# Altium schematic sheet Controller.SchDoc
size A2
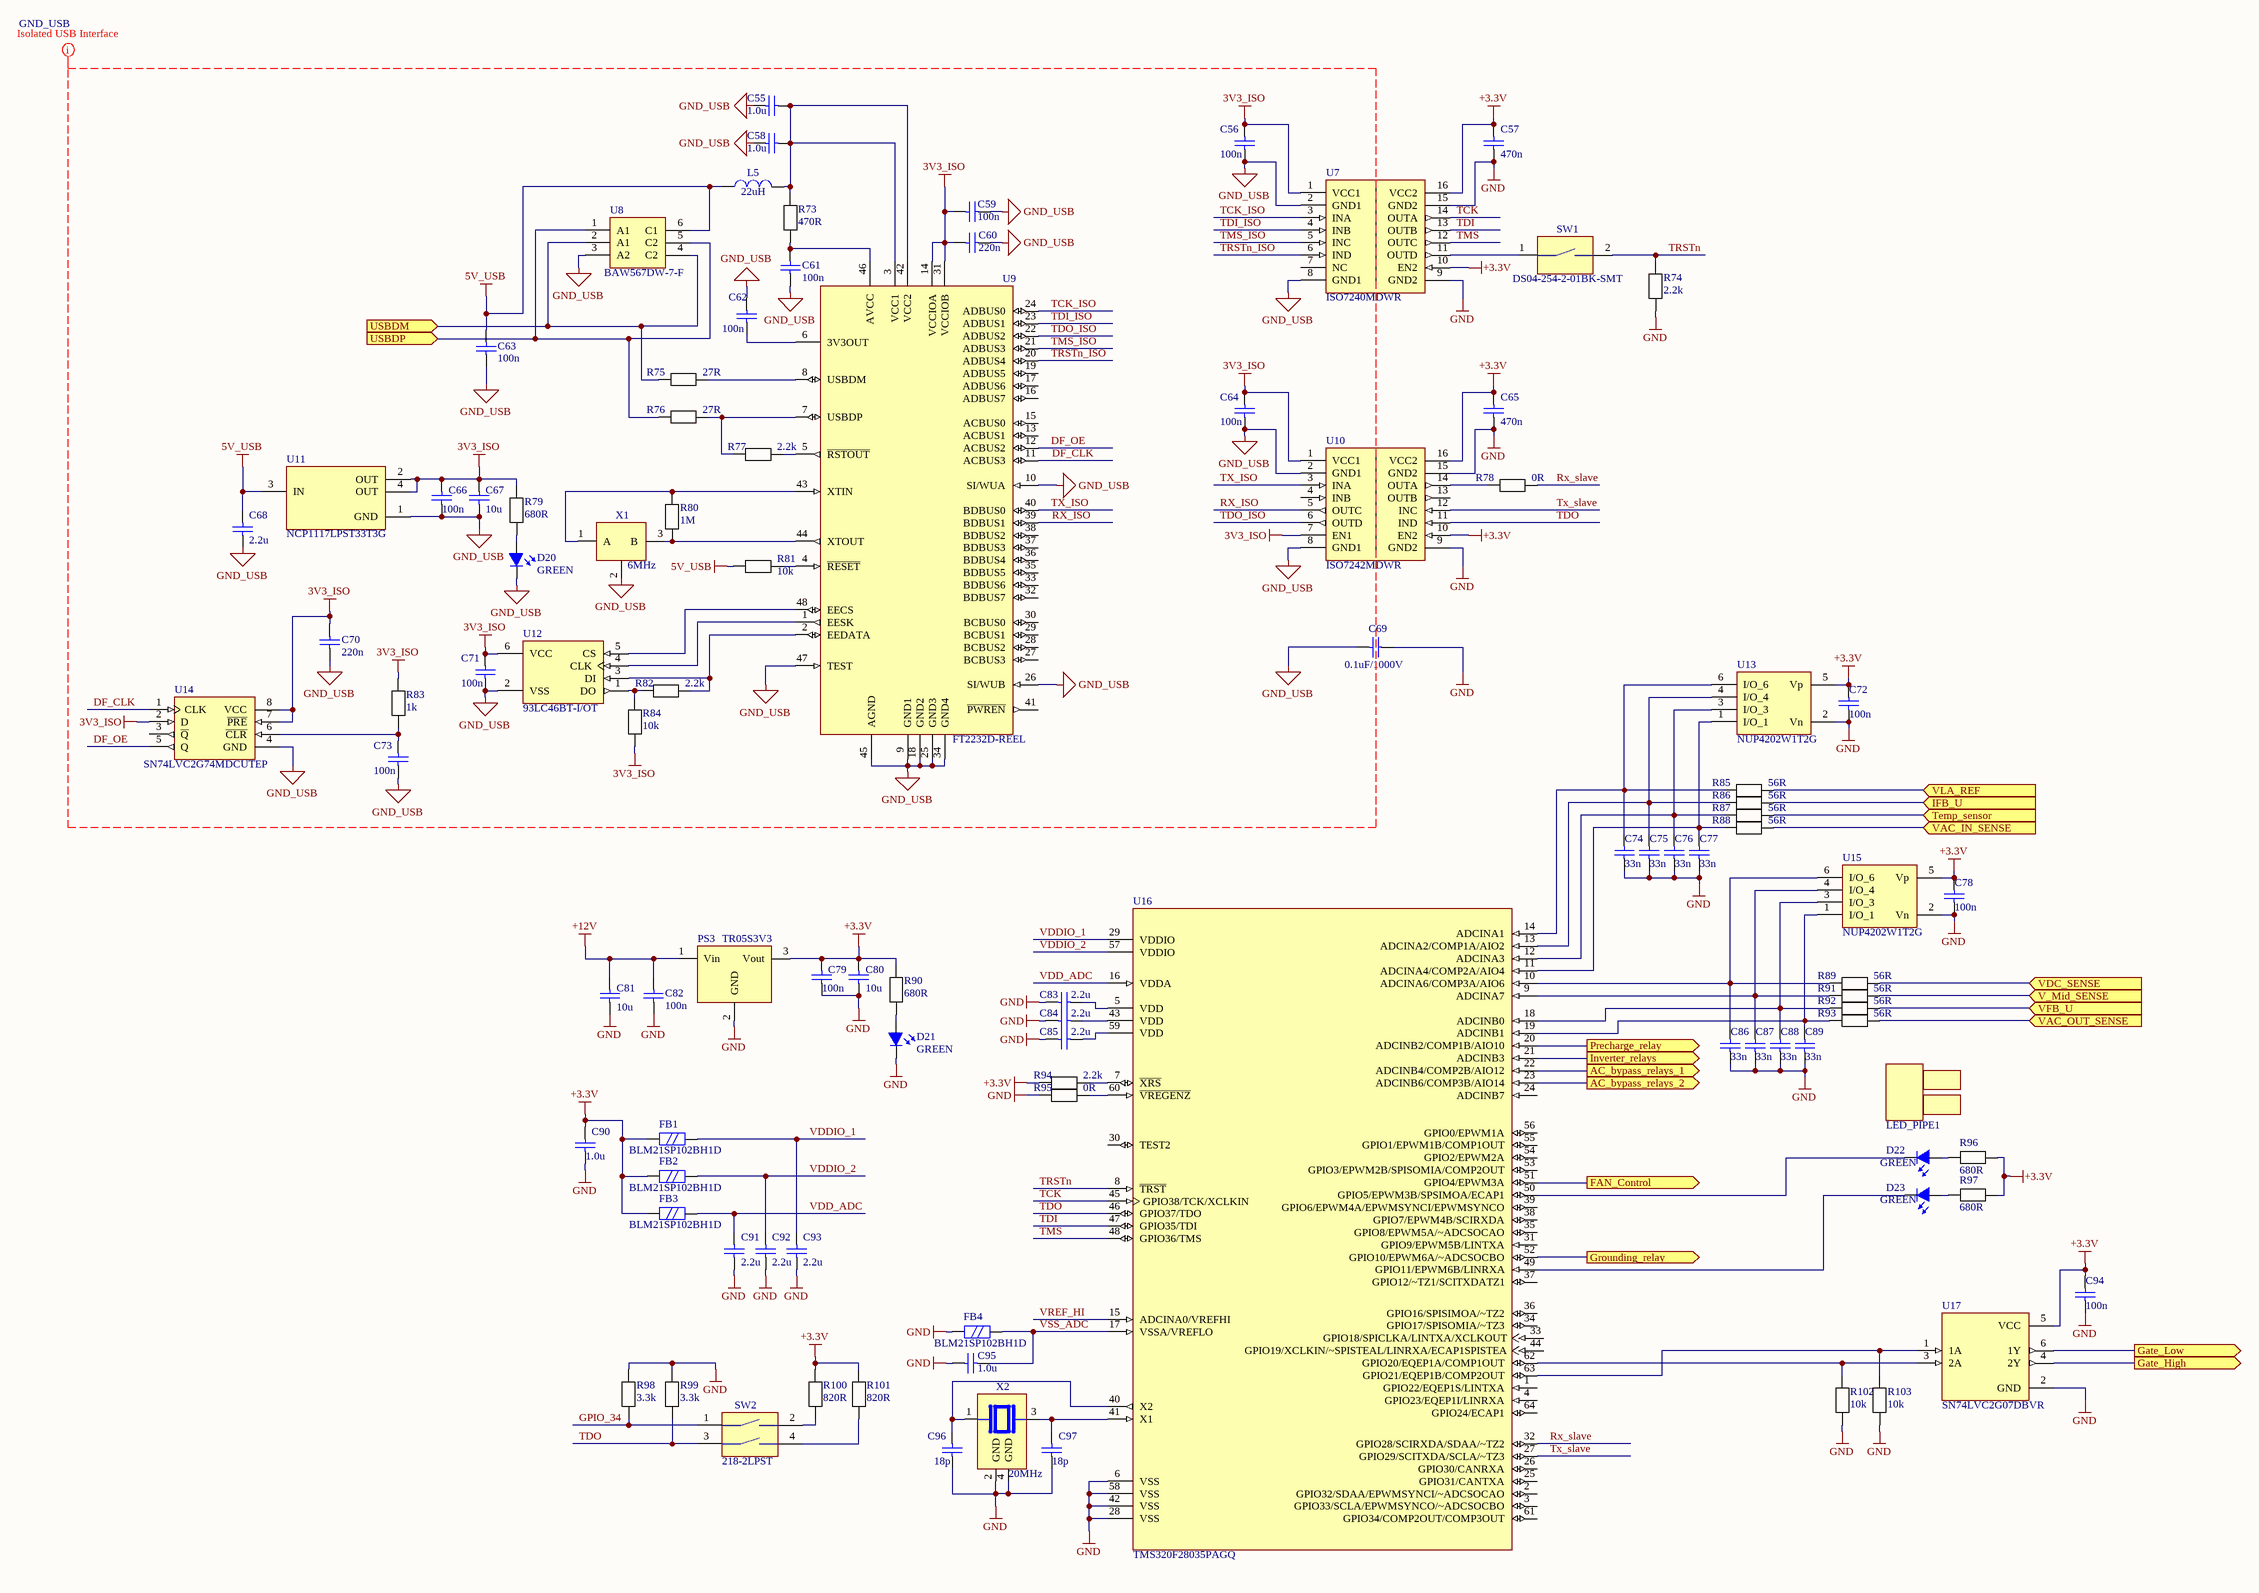
[diagram p0: Controller.SchDoc]

## Parts
C55  1.0u  [C0603]
C56  100n  [C0603]
C57  470n  [C0603]
C58  1.0u  [C0603]
C59  100n  [C0603]
C60  220n  [C0603]
C61  100n  [C0603]
C62  100n  [C0603]
C63  100n  [C0603]
C64  100n  [C0603]
C65  470n  [C0603]
C66  100n  [C0603]
C67  10u  [C1206]
C68  2.2u  [C0603]
C69  0.1uF/1000V  [C1812]
C70  220n  [C0603]
C71  100n  [C0603]
C72  100n  [C0603]
C73  100n  [C0603]
C74  33n  [C0603]
C75  33n  [C0603]
C76  33n  [C0603]
C77  33n  [C0603]
C78  100n  [C0603]
C79  100n  [C0603]
C80  10u  [C1206]
C81  10u  [C1206]
C82  100n  [C0603]
C83  2.2u  [C0603]
C84  2.2u  [C0603]
C85  2.2u  [C0603]
C86  33n  [C0603]
C87  33n  [C0603]
C88  33n  [C0603]
C89  33n  [C0603]
C90  1.0u  [C0603]
C91  2.2u  [C0603]
C92  2.2u  [C0603]
C93  2.2u  [C0603]
C94  100n  [C0603]
C95  1.0u  [C0603]
C96  18p  [C0603]
C97  18p  [C0603]
D20  GREEN  [LED0805]
D21  GREEN  [LED0805]
D22  GREEN  [LED0805]
D23  GREEN  [LED0805]
FB1  BLM21SP102BH1D  [R0805]
FB2  BLM21SP102BH1D  [R0805]
FB3  BLM21SP102BH1D  [R0805]
FB4  BLM21SP102BH1D  [R0805]
L5  22uH  [IND_NRH3012T]
LED_PIPE1  RLP2-400-800  [RLP2-400-800]  (value not drawn)
PS3  TR05S3V3  [TR05S3V3]
R73  470R  [R0603]
R74  2.2k  [R0603]
R75  27R  [R0603]
R76  27R  [R0603]
R77  2.2k  [R0603]
R78  0R  [R0603]
R79  680R  [R0603]
R80  1M  [R0603]
R81  10k  [R0603]
R82  2.2k  [R0603]
R83  1k  [R0603]
R84  10k  [R0603]
R85  56R  [R0603]
R86  56R  [R0603]
R87  56R  [R0603]
R88  56R  [R0603]
R89  56R  [R0603]
R90  680R  [R0603]
R91  56R  [R0603]
R92  56R  [R0603]
R93  56R  [R0603]
R94  2.2k  [R0603]
R95  0R  [R0603]
R96  680R  [R0603]
R97  680R  [R0603]
R98  3.3k  [R0603]
R99  3.3k  [R0603]
R100  820R  [R0603]
R101  820R  [R0603]
R102  10k  [R0603]
R103  10k  [R0603]
SW1  DS04-254-2-01BK-SMT  [SW_DS04-254-2-01BK-SMT]
SW2  218-2LPST  [218-2LPST]
U7  ISO7240MDWR  [SOIC127P1030X265-16N]
U8  BAW567DW-7-F  [SOT65P210X110-6N]
U9  FT2232D-REEL  [LQFP48]
U10  ISO7242MDWR  [SOIC127P1030X265-16N]
U11  NCP1117LPST33T3G  [SOT223R]
U12  93LC46BT-I/OT  [SOT95P280X145-6N]
U13  NUP4202W1T2G  [SOT65P210X110-6N]
U14  SN74LVC2G74MDCUTEP  [SOP50P310X90-8N]
U15  NUP4202W1T2G  [SOT65P210X110-6N]
U16  TMS320F28035PAGQ  [QFP50P1200X1200X120-64N]
U17  SN74LVC2G07DBVR  [SOT95P280X145-6N]
X1  6MHz  [OSC_CSTCR6M00G53-R0]
X2  20MHz  [XTAL_AMB8]

## Ports
AC_bypass_relays_1 (out), AC_bypass_relays_2 (out), FAN_Control (out), Gate_High (out), Gate_Low (out), Grounding_relay (out), IFB_U (in), Inverter_relays (out), Precharge_relay (out), Temp_sensor (in), USBDM (in), USBDP (in), V_Mid_SENSE (in), VAC_IN_SENSE (in), VAC_OUT_SENSE (in), VDC_SENSE (in), VFB_U (in), VLA_REF (in)

## Nets
3V3_ISO: C56.2 C59.2 C60.2 C64.2 C66.2 C67.2 C70.2 C71.2 R79.2 R83.2 R84.1 U7.1(VCC1) U9.14(VCCIOA) U9.31(VCCIOB) U10.1(VCC1) U10.7(EN1) U11.2(OUT) U11.4(OUT) U12.6(VCC) U14.2(D) U14.7(~{PRE}) U14.8(VCC)
5V_USB: C63.2 C68.2 L5.1 R81.1 U8.6(C1) U11.3(IN)
+3.3V: C57.2 C65.2 C72.2 C78.2 C79.2 C80.2 C90.2 C94.2 FB1.2 FB2.2 FB3.2 PS3.3(Vout) R90.2 R94.1 R96.2 R97.2 R100.2 R101.2 U7.10(EN2) U7.16(VCC2) U10.10(EN2) U10.16(VCC2) U13.5(Vp) U15.5(Vp) U17.5(VCC)
+12V: C81.2 C82.2 PS3.1(Vin)
GND: C57.1 C65.1 C69.1 C72.1 C74.1 C75.1 C76.1 C77.1 C78.1 C79.1 C80.1 C81.1 C82.1 C83.1 C84.1 C85.1 C86.1 C87.1 C88.1 C89.1 C90.1 C91.1 C92.1 C93.1 C94.1 C95.1 C96.1 C97.1 D21.C FB4.2 PS3.2(GND) R74.1 R95.1 R98.2 R99.2 R102.1 R103.1 U7.9(GND2) U7.15(GND2) U10.9(GND2) U10.15(GND2) U13.2(Vn) U15.2(Vn) U16.6(VSS) U16.28(VSS) U16.42(VSS) U16.58(VSS) U17.2(GND) X2.2(GND) X2.4(GND)
GND_USB: C55.1 C56.1 C58.1 C59.1 C60.1 C61.1 C62.1 C63.1 C64.1 C66.1 C67.1 C68.1 C69.2 C70.1 C71.1 C73.1 D20.C U7.2(GND1) U7.8(GND1) U8.3(A2) U9.9(GND1) U9.10(SI/WUA) U9.18(GND2) U9.25(GND3) U9.26(SI/WUB) U9.34(GND4) U9.45(AGND) U9.47(TEST) U10.2(GND1) U10.8(GND1) U11.1(GND) U12.2(VSS) U14.4(GND) X1.2(GND)
AC_bypass_relays_1: U16.22(ADCINB4/COMP2B/AIO12) ; port AC_bypass_relays_1
AC_bypass_relays_2: U16.23(ADCINB6/COMP3B/AIO14) ; port AC_bypass_relays_2
DF_CLK: U9.11(ACBUS3) U14.1(CLK)
DF_OE: U9.12(ACBUS2) U14.5(Q)
FAN_Control: U16.51(GPIO4/EPWM3A) ; port FAN_Control
Gate_High: U17.4(2Y) ; port Gate_High
Gate_Low: U17.6(1Y) ; port Gate_Low
GPIO_34: R98.1 SW2.1
Grounding_relay: U16.52(GPIO10/EPWM6A/~ADCSOCBO) ; port Grounding_relay
IFB_U: R86.1 ; port IFB_U
Inverter_relays: U16.21(ADCINB3) ; port Inverter_relays
Precharge_relay: U16.20(ADCINB2/COMP1B/AIO10) ; port Precharge_relay
RX_ISO: U9.39(BDBUS1) U10.5(OUTC)
Rx_slave: R78.2 U16.32(GPIO28/SCIRXDA/SDAA/~TZ2)
TCK: U7.14(OUTA) U16.45(GPIO38/TCK/XCLKIN)
TCK_ISO: U7.3(INA) U9.24(ADBUS0)
TDI: U7.13(OUTB) U16.47(GPIO35/TDI)
TDI_ISO: U7.4(INB) U9.23(ADBUS1)
TDO: R99.1 SW2.3 U10.11(IND) U16.46(GPIO37/TDO)
TDO_ISO: U9.22(ADBUS2) U10.6(OUTD)
Temp_sensor: R87.1 ; port Temp_sensor
TMS: U7.12(OUTC) U16.48(GPIO36/TMS)
TMS_ISO: U7.5(INC) U9.21(ADBUS3)
TRSTn: R74.2 SW1.2 U16.8(~{TRST})
TRSTn_ISO: U7.6(IND) U9.20(ADBUS4)
TX_ISO: U9.40(BDBUS0) U10.3(INA)
Tx_slave: U10.12(INC) U16.27(GPIO29/SCITXDA/SCLA/~TZ3)
USBDM: R75.2 U8.2(A1) U8.4(C2) ; port USBDM
USBDP: R76.2 U8.1(A1) U8.5(C2) ; port USBDP
V_Mid_SENSE: R91.1 ; port V_Mid_SENSE
VAC_IN_SENSE: R88.1 ; port VAC_IN_SENSE
VAC_OUT_SENSE: R93.1 ; port VAC_OUT_SENSE
VDC_SENSE: R89.1 ; port VDC_SENSE
VDD_ADC: C91.2 FB3.1 U16.16(VDDA)
VDDIO_1: C93.2 FB1.1 U16.29(VDDIO)
VDDIO_2: C92.2 FB2.1 U16.57(VDDIO)
VFB_U: R92.1 ; port VFB_U
VLA_REF: R85.1 ; port VLA_REF
VREF_HI: U16.15(ADCINA0/VREFHI)
VSS_ADC: C95.2 FB4.1 U16.17(VSSA/VREFLO)
NetC55_2: C55.2 C58.2 L5.2 R73.1 U9.3(VCC1) U9.42(VCC2)
NetC61_2: C61.2 R73.2 U9.46(AVCC)
NetC62_2: C62.2 U9.6(3V3OUT)
NetC73_2: C73.2 R83.1 U14.6(~{CLR})
NetC74_2: C74.2 R85.2 U13.6(I/O_6) U16.14(ADCINA1)
NetC75_2: C75.2 R86.2 U13.4(I/O_4) U16.13(ADCINA2/COMP1A/AIO2)
NetC76_2: C76.2 R87.2 U13.3(I/O_3) U16.12(ADCINA3)
NetC77_2: C77.2 R88.2 U13.1(I/O_1) U16.11(ADCINA4/COMP2A/AIO4)
NetC83_2: C83.2 U16.5(VDD)
NetC84_2: C84.2 U16.43(VDD)
NetC85_2: C85.2 U16.59(VDD)
NetC86_2: C86.2 R89.2 U15.6(I/O_6) U16.10(ADCINA6/COMP3A/AIO6)
NetC87_2: C87.2 R91.2 U15.4(I/O_4) U16.9(ADCINA7)
NetC88_2: C88.2 R92.2 U15.3(I/O_3) U16.18(ADCINB0)
NetC89_2: C89.2 R93.2 U15.1(I/O_1) U16.19(ADCINB1)
NetC96_2: C96.2 U16.40(X2) X2.1
NetC97_2: C97.2 U16.41(X1) X2.3
NetD20_A: D20.A R79.1
NetD21_A: D21.A R90.1
NetD22_A: D22.A R96.1
NetD22_C: D22.C U16.50(GPIO5/EPWM3B/SPSIMOA/ECAP1)
NetD23_A: D23.A R97.1
NetD23_C: D23.C U16.49(GPIO11/EPWM6B/LINRXA)
NetR75_1: R75.1 U9.8(USBDM)
NetR76_1: R76.1 R77.1 U9.7(USBDP)
NetR77_2: R77.2 U9.5(~{RSTOUT})
NetR78_1: R78.1 U10.14(OUTA)
NetR80_1: R80.1 U9.44(XTOUT) X1.3(B)
NetR80_2: R80.2 U9.43(XTIN) X1.1(A)
NetR81_2: R81.2 U9.4(~{RESET})
NetR82_1: R82.1 R84.2 U12.1(DO)
NetR82_2: R82.2 U9.2(EEDATA) U12.3(DI)
NetR94_2: R94.2 U16.7(~{XRS})
NetR95_2: R95.2 U16.60(~{VREGENZ})
NetR100_1: R100.1 SW2.2
NetR101_1: R101.1 SW2.4
NetR102_2: R102.2 U16.62(GPIO20/EQEP1A/COMP1OUT) U17.3(2A)
NetR103_2: R103.2 U16.63(GPIO21/EQEP1B/COMP2OUT) U17.1(1A)
NetSW1_1: SW1.1 U7.11(OUTD)
NetU9_1: U9.1(EESK) U12.4(CLK)
NetU9_48: U9.48(EECS) U12.5(CS)

Not connected (* = marked no-connect by the designer): U7 7(NC); U9 13(ACBUS1) 15(ACBUS0) 16(ADBUS7) 17(ADBUS6) 19(ADBUS5) 27(BCBUS3) 28(BCBUS2) 29(BCBUS1) 30(BCBUS0) 32(BDBUS7) 33(BDBUS6) 35(BDBUS5) 36(BDBUS4) 37(BDBUS3) 38(BDBUS2) 41(~{PWREN}); U10 4(INB) 13(OUTB); U14 3(~{Q}); U16 1(GPIO22/EQEP1S/LINTXA) 2(GPIO32/SDAA/EPWMSYNCI/~ADCSOCAO) 3(GPIO33/SCLA/EPWMSYNCO/~ADCSOCBO) 4(GPIO23/EQEP1I/LINRXA) 24(ADCINB7) 25(GPIO31/CANTXA) 26(GPIO30/CANRXA) 30(TEST2) 31(GPIO9/EPWM5B/LINTXA) 33(GPIO18/SPICLKA/LINTXA/XCLKOUT) 34(GPIO17/SPISOMIA/~TZ3) 35(GPIO8/EPWM5A/~ADCSOCAO) 36(GPIO16/SPISIMOA/~TZ2) 37(GPIO12/~TZ1/SCITXDATZ1) 38(GPIO7/EPWM4B/SCIRXDA) 39(GPIO6/EPWM4A/EPWMSYNCI/EPWMSYNCO) 44(GPIO19/XCLKIN/~SPISTEAL/LINRXA/ECAP1SPISTEA) 53(GPIO3/EPWM2B/SPISOMIA/COMP2OUT) 54(GPIO2/EPWM2A) 55(GPIO1/EPWM1B/COMP1OUT) 56(GPIO0/EPWM1A) 61(GPIO34/COMP2OUT/COMP3OUT) 64(GPIO24/ECAP1)

## Layout directives
net class GND_USB: 3V3_ISO, 5V_USB, DF_CLK, DF_OE, GND_USB, RX_ISO, TCK_ISO, TDI_ISO, TDO_ISO, TMS_ISO, TRSTn_ISO, TX_ISO

## Library data of the parts
C55 C58 = CAP_YAG_CC0603KRX7R9BB105_X7R: Capacitor 1.0u 0603 +-10% 50V; MFR: Yageo; Type: X7R; Voltage (V): 50; Part Number: CAP_YAG_CC0603KRX7R9BB105_X7R; MPN: CC0603KRX7R9BB105; Category: Capacitor; Package / Case: 0603; Capacitor (Farad): 1.0u; Tolerance: +-10%; Thickness (mm): 0.8; Value: 1.0u
C56 C59 C61 C62 C64 C66 C71-C73 C78 C79 C94 = CAP_YAG_CC0603KRX7R9BB104_X7R: Capacitor 100n 0603 +-10% 50V; MFR: Yageo; Type: X7R; Voltage (V): 50; Part Number: CAP_YAG_CC0603KRX7R9BB104_X7R; MPN: CC0603KRX7R9BB104; Category: Capacitor; Package / Case: 0603; Capacitor (Farad): 100n; Tolerance: +-10%; Thickness (mm): 0.8; Value: 100n
C57 C65 = CAP_YAG_CC0603KRX7R9BB474_X7R: Capacitor 470n 0603 +-10% 50V; MFR: Yageo; Type: X7R; Voltage (V): 50; Part Number: CAP_YAG_CC0603KRX7R9BB474_X7R; MPN: CC0603KRX7R9BB474; Category: Capacitor; Package / Case: 0603; Capacitor (Farad): 470n; Tolerance: +-10%; Thickness (mm): 0.8; Value: 470n
C60 C70 = CAP_YAG_CC0603KRX7R9BB224_X7R: Capacitor 220n 0603 +-10% 50V; MFR: Yageo; Type: X7R; Voltage (V): 50; Part Number: CAP_YAG_CC0603KRX7R9BB224_X7R; MPN: CC0603KRX7R9BB224; Category: Capacitor; Package / Case: 0603; Capacitor (Farad): 220n; Tolerance: +-10%; Thickness (mm): 0.8; Value: 220n
C63 C82 = CAP_YAG_CC0603KRX7R9BB104_X7R: Capacitor 100n 0603 +-10% 50V; Manufacturer: Yageo; Type: X7R; Voltage (V): 50; Part Number: CAP_YAG_CC0603KRX7R9BB104_X7R; Manufacturer Part Number: CC0603KRX7R9BB104; Category: Capacitor; Package / Case: 0603; Capacitor (Farad): 100n; Tolerance: +-10%; Thickness (mm): 0.8; Value: 100n
C67 C80 C81 = CAP_YAG_CC1206KKX7R8BB106: Capacitor 10u 1206 +-10% 25V; MFR: Yageo; Type: X7R; Voltage (V): 50; MPN: CC1206KKX7R8BB106; Category: Capacitor; Tolerance: +-10%; Value: 10u
C68 C83-C85 C91-C93 = CAP_YAG_CC0603KRX5R8BB225_X5R: Capacitor 2.2u 0603 +-10% 25V; MFR: Yageo; Type: X5R; Voltage (V): 25; Part Number: CAP_YAG_CC0603KRX5R8BB225_X5R; MPN: CC0603KRX5R8BB225; Category: Capacitor; Package / Case: 0603; Capacitor (Farad): 2.2u; Tolerance: +-10%; Thickness (mm): 0.8; Value: 2.2u
C69 = CAP: 0.1uF ±10% 1000V; MPN: C1812C104KDRACTU; MFR: KEMET; Value: 0.1uF/1000V
C74-C77 C86-C89 = CAP_YAG_CC0603KRX7R9BB333_X7R: Capacitor 33n 0603 +-10% 50V; MFR: Yageo; Type: X7R; Voltage (V): 50; Part Number: CAP_YAG_CC0603KRX7R9BB333_X7R; MPN: CC0603KRX7R9BB333; Category: Capacitor; Package / Case: 0603; Capacitor (Farad): 33n; Tolerance: +-10%; Thickness (mm): 0.8; Value: 33n
C90 C95 = CAP_YAG_CC0603KRX5R8BB105_X5R: Capacitor 1.0u 0603 +-10% 25V; MFR: Yageo; MPN: CC0603KRX7R9BB105; Type: X5R; Voltage (V): 25; Part Number: CAP_YAG_CC0603KRX5R8BB105_X5R; Category: Capacitor; Package / Case: 0603; Capacitor (Farad): 1.0u; Tolerance: +-10%; Thickness (mm): 0.8; Value: 1.0u
C96 C97 = CAP_YAG_CC0603KRNPO9BN180_NPO: Capacitor 18p 0603 +-10% 50V; MFR: Yageo; Type: NPO; Voltage (V): 50; Part Number: CAP_YAG_CC0603KRNPO9BN180_NPO; MPN: CC0603KRNPO9BN180; Category: Capacitor; Package / Case: 0603; Capacitor (Farad): 18p; Tolerance: +-10%; Thickness (mm): 0.8; Value: 18p
D20-D23 = LED_SMD: SMD Surface Mount LED, 5 mA; MPN: VCDG1112H-4BY3C-TR; MFR: Stanley Electric; Value: GREEN
FB1-FB4 = SMD_FB: FERRITE BEAD 1 KOHM 0805 1LN; MFR: Murata Electronics; Value: BLM21SP102BH1D; MPN: BLM21SP102BH1D
L5 = Inductor: Power Inductors - SMD 3012 22uH 756mOhms +/-20%Tol 500mA; MPN: NRH3012T220MN; MFR: Taiyo Yuden; Value: 22uH
LED_PIPE1 = RLP2-400-800: LED Light Pipes SMD Double RA 2.8mm 20mm Protrusion; MFR: Bivar; MPN: RLP2-400-800; Value: RLP2-400-800
PS3 = TR05S3V3: Non-Isolated DC/DC Converters DC-DC CONV, SWITCHING REG, 0.5A; MFR: XP Power; MPN: TR05S3V3; Value: TR05S3V3
R73 = RES: 0.1W/ 470ohm±1%; MPN: RC0603FR-0470RL; MFR: Yageo; Value: 470R
R74 R77 R82 R94 = RES: 0.1W/ 2.2kohm±1%; MPN: RC0603FR-072K2L; MFR: Yageo; Value: 2.2k
R75 R76 = RES: 0.1W/ 27ohm±1%; MPN: RC0603FR-027RL; MFR: Yageo; Value: 27R
R78 R95 = RES: 0.1W/ 0ohm±1%; MPN: RC0603FR-070RL; MFR: Yageo; Value: 0R
R79 R90 R96 R97 = RES: 0.1W/ 680ohm±1%; MPN: RC0603FR-0680RL; MFR: Yageo; Value: 680R
R80 = RES: 0.1W/ 1Mohm±1%; MPN: RC0603FR-071ML; MFR: Yageo; Value: 1M
R81 R84 R102 R103 = RES: 0.1W/ 10kohm±1%; MPN: RC0603FR-0710KL; MFR: Yageo; Value: 10k
R83 = RES: 0.1W/ 1kohm±1%; MPN: RC0603FR-071KL; MFR: Yageo; Value: 1k
R85-R89 R91-R93 = RES: 0.1W/ 56ohm±1%; MPN: RC0603FR-056RL; MFR: Yageo; Value: 56R
R98 R99 = RES: 0.1W/ 3.3kohm±1%; MPN: RC0603FR-073K3L; MFR: Yageo; Value: 3.3k
R100 R101 = RES: 0.1W/ 820ohm±1%; MPN: RC0603FR-0820RL; MFR: Yageo; Value: 820R
SW1 = 1POS_DIPSW: DIP Switches/SIP Switches 1 12 Positions, Surface Mount, 2.54 mm Pitch, Slide Actuator, DIP Switch; MFR: CUI Devices; MPN: DS04-254-2-01BK-SMT; Value: DS04-254-2-01BK-SMT
SW2 = 218-2LPST: DIP Switches/SIP Switches SPST 2 switch sections; MFR: CTS Electronic Components; MPN: 218-2LPST; Value: 218-2LPST
U7 = ISO7240MDWR: Digital Isolators Quad Ch 4/0 150Mbps Digi Iso; MFR: Texas Instruments; Package: None; Price: None; Value: ISO7240MDWR; MPN: ISO7240MDWR; Availability: Unavailable
U8 = BAW567DW-7-F: Diodes - General Purpose, Power, Switching 75V 200mW; MFR: Microchip; MPN: BAW567DW-7-F; Value: BAW567DW-7-F
U9 = FT2232D: USB Bridge, USB to UART USB 2.0 UART Interface 48-LQFP _7x7_; MFR: FTDI, Future; Price: None; Availability: Unavailable; Package: LQFP-48 FTDI; MPN: FT2232D-REEL; Value: FT2232D-REEL; SnapEDA_Link: https://www.snapeda.com/parts/FT2232D/FTDI%2C%20Future%20Technology%20Devices%20International%20Ltd/view-part/43700/?ref=snap
U10 = ISO7242MDWR: Digital Isolators Quad Ch 2/2 150Mbps Dig Iso; MFR: Texas Instruments; Package: None; Price: None; Value: ISO7242MDWR; MPN: ISO7242MDWR; Availability: Unavailable
U11 = LD1117S33TR: LDO Voltage Regulators LOW DROPOUT REGULATORS; MFR: onsemi; Price: 0.46; MPN: NCP1117LPST33T3G; Supplier Part Number: 863-NCP1117LPST33T3G; Value: NCP1117LPST33T3G; Supplier: Mouser
U12 = 93LC46BT-I/OT: EEPROM Memory IC 1Kb _64 x 16_ SPI 2MHz SOT-23-6; MFR: Microchip; Availability: Unavailable; SnapEDA_Link: https://www.snapeda.com/parts/93LC46BT-I/OT/Microchip/view-part/106889/?ref=snap; Price: None; Package: SOT-23-6 Microchip; MPN: 93LC46BT-I/OT; Value: 93LC46BT-I/OT
U13 U15 = NUP4202W1T2G: ESD Suppressors / TVS Diodes LOW CAP DIODE TVS ARRAY; MFR: onsemi; MPN: NUP4202W1T2G; Value: NUP4202W1T2G
U14 = SN74LVC2G74MDCUTEP: Flip-Flops Sgl Pos Edge Trgrd D-Type Flip-Flop; MFR: Texas Instruments; Package: None; Price: None; Value: SN74LVC2G74MDCUTEP; MPN: SN74LVC2G74MDCUTEP; Availability: Unavailable
U16 = TMS320F28035PAGQ: 32-bit Microcontrollers - MCU Piccolo Microcntrlr; MFR: Texas Instruments; Package: None; Price: None; Value: TMS320F28035PAGQ; MPN: TMS320F28035PAGQ; Availability: Unavailable
U17 = SN74LVC2G07DBVR: Dual Buffer/Driver with Open-Drain Output 6-SOT-23 -40 to 125; MFR: Texas Instruments; Package: SOT-23-6 Texas Instruments; Availability: Unavailable; SnapEDA_Link: https://www.snapeda.com/parts/SN74LVC2G07DBVR/Texas%20Instruments/view-part/381627/?ref=snap; MPN: SN74LVC2G07DBVR; Price: None; Value: SN74LVC2G07DBVR; Texas_Instruments-Purchase-URL: https://snapeda.com/shop?store=Texas+Instruments&id=381627
X1 = XTAL: Resonators 6.0 MHZ; MPN: CSTCR6M00G53-R0; MFR: Murata; Value: 6MHz
X2 = ABM8-20.000MHZ: Crystals CRYSTAL 20.0000MHZ 10PF SMD; MPN: ABM8-20.000MHZ-10-B1U-T; MFR: ABRACON; Value: 20MHz